# EasyEDA schematic 4-channel-1001-to-1-attenuator.json
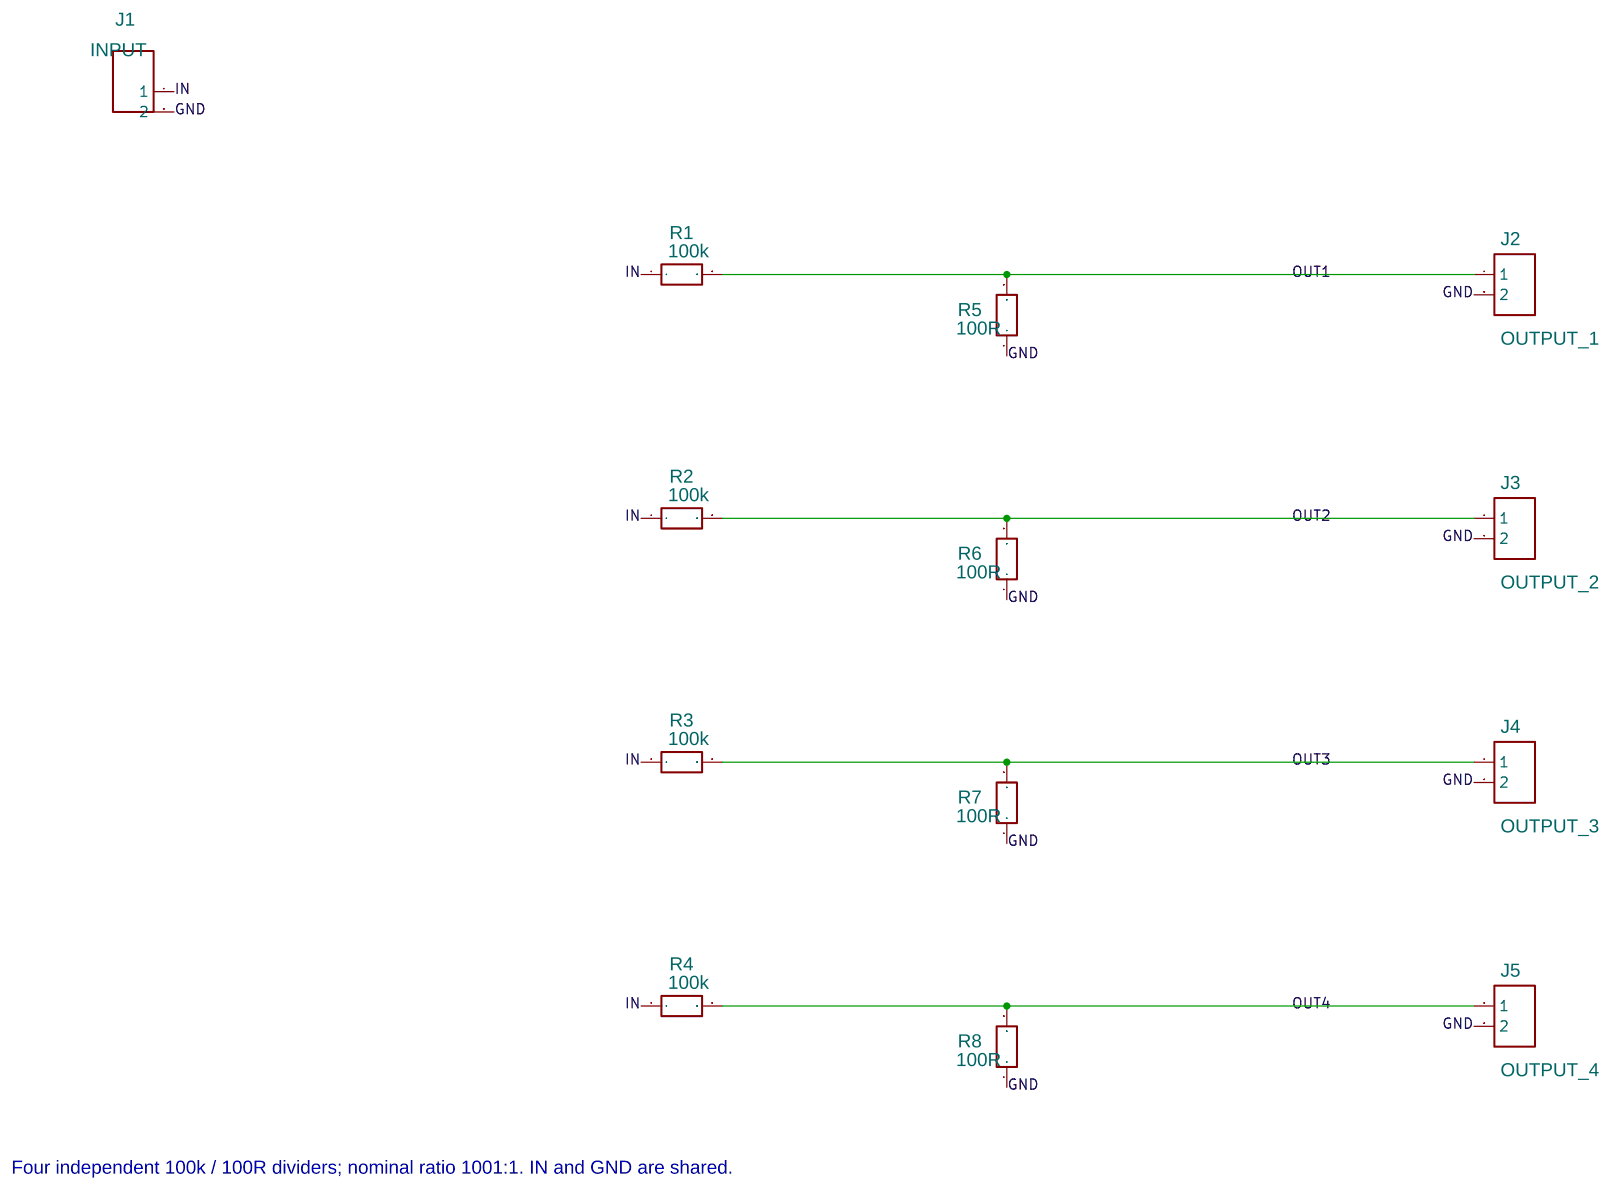
[diagram p0: schematic sheet]

## Parts
J1  INPUT  [HDR-M-2.54_1X2]
J2  OUTPUT_1  [HDR-M-2.54_1X2]
J3  OUTPUT_2  [HDR-M-2.54_1X2]
J4  OUTPUT_3  [HDR-M-2.54_1X2]
J5  OUTPUT_4  [HDR-M-2.54_1X2]
R1  100k  [R0805]
R2  100k  [R0805]
R3  100k  [R0805]
R4  100k  [R0805]
R5  100R  [R0805]
R6  100R  [R0805]
R7  100R  [R0805]
R8  100R  [R0805]

## Library data of the parts
J1-J5 = HDR-M-2.54_1x2: Contributor: LCEDA_Lib
R1-R8 = R_0805_EU: Contributor: LCEDA_Lib

## Nets
GND: J1.2 J2.2 J3.2 J4.2 J5.2 R5.1 R6.1 R7.1 R8.1
IN: J1.1 R1.1 R2.1 R3.1 R4.1
OUT1: J2.1 R1.2 R5.2
OUT2: J3.1 R2.2 R6.2
OUT3: J4.1 R3.2 R7.2
OUT4: J5.1 R4.2 R8.2

## Notes on the sheet
- Four independent 100k / 100R dividers; nominal ratio 1001:1. IN and GND are shared.
